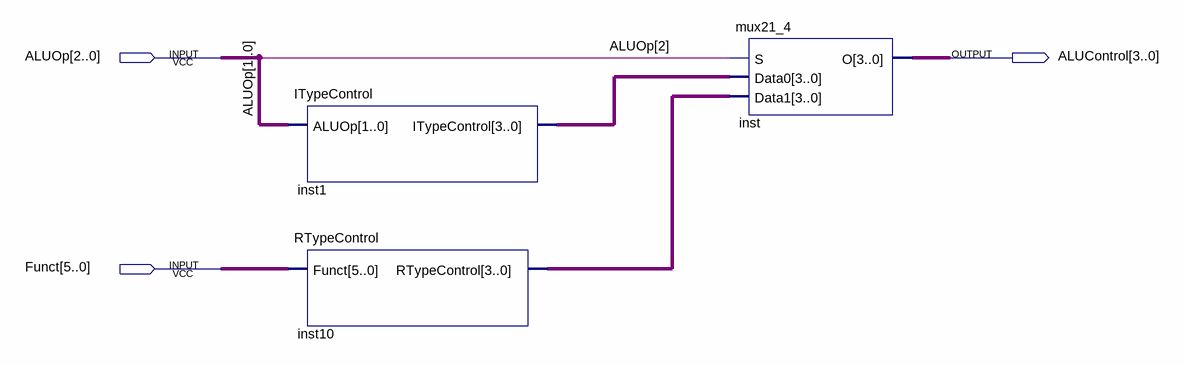
[diagram p0: schematic sheet]
// Quartus schematic ALUControl.bdf as structural Verilog: 3 symbols, 3 pins
module ALUControl (
  input  [2:0] ALUOp,
  input  [5:0] Funct,
  output [3:0] ALUControl
);

  wire [3:0] inst1_itypecontrol, inst10_rtypecontrol;

  ITypeControl inst1 (.ALUOp(ALUOp[1:0]), .ITypeControl(inst1_itypecontrol));
  RTypeControl inst10 (.Funct(Funct), .RTypeControl(inst10_rtypecontrol));
  mux21_4 inst (.S(ALUOp[2]), .Data0(inst1_itypecontrol), .Data1(inst10_rtypecontrol), .O(ALUControl));
endmodule
